# Altium schematic sheet POWER.SchDoc: LED Cube 8x8x8 - POWER
size A4; Author: Luka Penger; CompanyName: L. Penger; DrawnBy: Luka Penger; Organization: L. Penger; Address1: Luka Penger; Address2: http://lukapenger.eu; Address3: Software & Hardware; Address4: Development; DocumentNumber: 2; Revision: 3.0.0; SheetNumber: 2; SheetTotal: 5; DocumentName: POWER; ProjectName: LED Cube 8x8x8
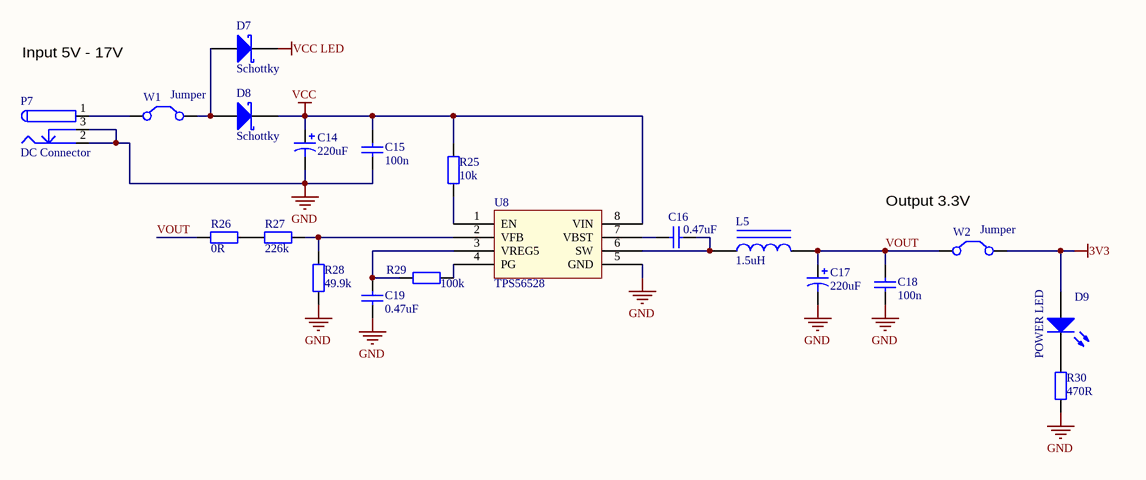
[diagram p0: POWER.SchDoc]

## Parts
C14  220uF  [SMD CAPACITOR 220uF]
C15  100n  [1608[0603]]
C16  0.47uF  [1608[0603]]
C17  220uF  [SMD CAPACITOR 220uF]
C18  100n  [1608[0603]]
C19  0.47uF  [1608[0603]]
D7  Schottky  [SMB]
D8  Schottky  [SMB]
D9  POWER LED  [LED-1]
L5  1.5uH  [Inductor]
P7  DC Connector  [DC Connector]
R25  10k  [1608[0603]]
R26  0R  [1608[0603]]
R27  226k  [1608[0603]]
R28  49.9k  [1608[0603]]
R29  100k  [1608[0603]]
R30  470R  [1608[0603]]
U8  TPS56528  [TPS56528]
W1  Jumper  [HDR1X2]
W2  Jumper  [HDR1X2]

## Nets
3V3: D9.1(A) W2.2(C2)
GND: C14.2 C15.2 C17.2 C18.2 C19.2 P7.2 P7.3 R28.1 R30.1 U8.5(GND)
VCC: C14.1 C15.1 D8.2(K) R25.2 U8.8(VIN)
VCC LED: D7.2(K)
VOUT: C17.1 C18.1 L5.2 R26.2 W2.1(C1)
NetC16_1: C16.1 U8.7(VBST)
NetC16_2: C16.2 L5.1 U8.6(SW)
NetC19_1: C19.1 R29.2 U8.3(VREG5)
NetD7_1: D7.1(A) D8.1(A) W1.2(C2)
NetD9_2: D9.2(K) R30.2
NetP7_1: P7.1 W1.1(C1)
NetR25_1: R25.1 U8.1(EN)
NetR26_1: R26.1 R27.2
NetR27_1: R27.1 R28.2 U8.2(VFB)
NetR29_1: R29.1 U8.4(PG)

## Notes on the sheet
- Input 5V - 17V
- (near W2) Output 3.3V
- Title
- Size:
- Date:
- A4
- Number:
- Time:
- Revision:
- Sheet
- of
- File:

## Library data of the parts
C14 C17 = Cap Pol1: Capacitor; Value: 100pF; Published: 8-Jun-2000; LatestRevisionDate: 17-Jul-2002; LatestRevisionNote: Re-released for DXP Platform.; PackageReference: RB7.6-15; Publisher: Altium Limited; PackageDescription: Polarized Capacitor (Radial); 2 Leads
C15 C16 C18 C19 = Cap: Capacitor; Value: 100pF; Published: 8-Jun-2000; LatestRevisionDate: 17-Jul-2002; LatestRevisionNote: Re-released for DXP Platform.; PackageReference: RAD-0.3; Publisher: Altium Limited; PackageDescription: Radial Cap, Thru-Hole; 2 Leads; 0.3 in Pin Spacing
D7 D8 = D Schottky: Schottky Diode; Published: 8-Jun-2000; LatestRevisionDate: 17-Jul-2002; LatestRevisionNote: Re-released for DXP Platform.; PackageReference: SMB; Publisher: Altium Limited; PackageDescription: DO-214-AA/SMB; 2 C-Bend Leads; Body 5.3 x 3.6 mm, inc. leads (LxW); Code_JEDEC: DO-214-AA
D9 = LED0: Typical INFRARED GaAs LED; Published: 8-Jun-2000; LatestRevisionDate: 08-Jul-2005; LatestRevisionNote: Mech Layer 1 removed.; PackageReference: LED-0; Publisher: Altium Limited; PackageDescription: LED; 2 Leads
L5 = Inductor Iron: Magnetic-Core Inductor; Value: 10mH; Published: 24-Mar-1999; LatestRevisionDate: 17-Jul-2002; LatestRevisionNote: Re-released for DXP Platform.; PackageReference: AXIAL-0.9; Publisher: Altium Limited; PackageDescription: Axial Device, Thru-Hole; 2 Leads; 0.9 in Pin Spacing
P7 = DC Connector: DC Power Connector
R25-R30 = Res2: Resistor; Value: 1K; Published: 8-Jun-2000; LatestRevisionDate: 17-Jul-2002; LatestRevisionNote: Re-released for DXP Platform.; PackageReference: AXIAL-0.4; Publisher: Altium Limited; PackageDescription: Axial Device, Thru-Hole; 2 Leads; 0.4 in Pin Spacing
U8 = TPS56528: Step-Down Converter 5A 4.5V-18V
W1 W2 = Jumper: Jumper Wire; Published: 24-Mar-1999; LatestRevisionDate: 17-Jul-2002; LatestRevisionNote: Re-released for DXP Platform.; PackageReference: RAD-0.2; Publisher: Altium Limited; PackageDescription: Radial Cap, Thru-Hole; 2 Leads; 0.2 in Pin Spacing